# Altium schematic sheet microcontrolador.SchDoc
size A4
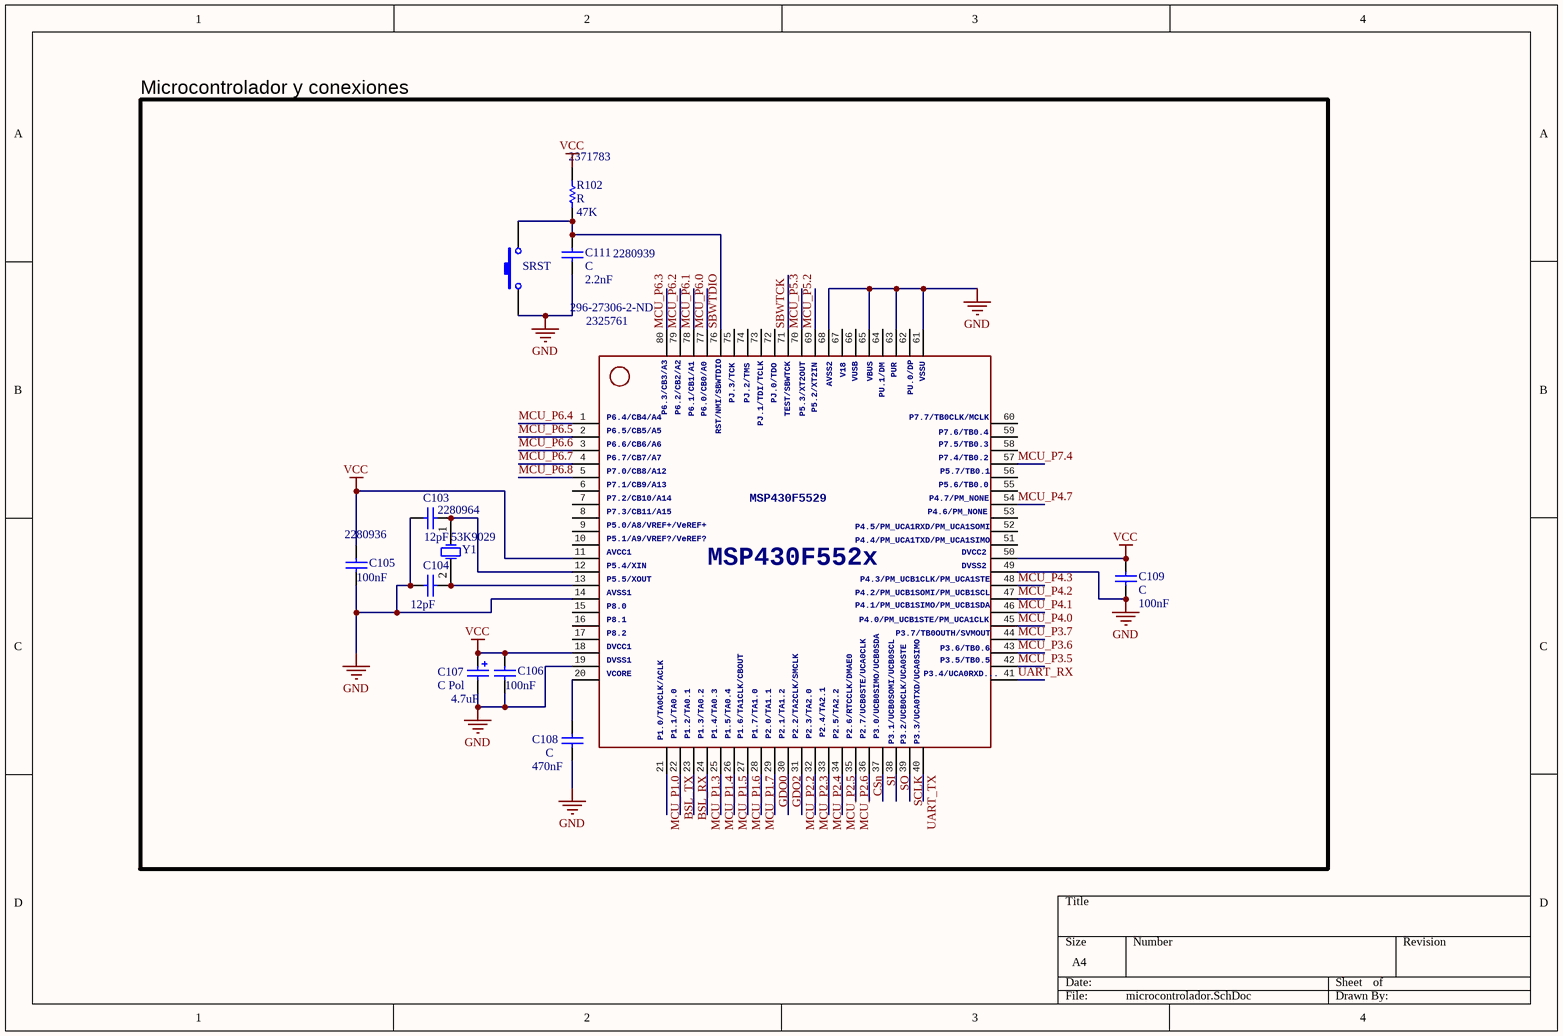
[diagram p0: microcontrolador.SchDoc]

## Parts
C103  value 12pF  Supplier Part Number 1: 2280964  [0805 CAP]  (hidden comment: C)
C104  value 12pF  [0805 CAP]  (hidden comment: C)
C105  value 100nF  Supplier Part Number 2: 2280936  [0805 CAP]  (hidden comment: C)
C106  value 100nF  [0805 CAP]  (hidden comment: C)
C107  C Pol  value 4.7uF  [0805]
C108  C  value 470nF  [0805 CAP]
C109  C  value 100nF  [0805 CAP]
C111  C  value 2.2nF  Supplier Part Number 1: 2280939  [0805 CAP]
MSP430F5529  P3.4/UCA...: P3.4/UCA0RXD...  Supplier Part Number 1: 2325761  Supplier Part Number 2: 296-27306-2-ND  [TI-PN80_N]  (hidden comment: MSP430F5529IPNR)
R102  R  value 47K  Supplier Part Number 1: 2371783  [0805 RES]
SRST  Pulsador  [B3U-1000P]  (value not drawn)
Y1  Supplier Part Number 1: 53K9029  [R38]  (hidden comment: XTAL_CFPX-157_32.768K_SMD)

## Blocks framed on the sheet
Microcontrolador y conexiones: C103-C109 C111 MSP430F5529 R102 SRST Y1

## Nets
GND: C103.1 C104.1 C105.2 C106.2 C107.2 C108.1 C109.1 C111.1 MSP430F5529.14 MSP430F5529.19 MSP430F5529.49 MSP430F5529.61 MSP430F5529.63 MSP430F5529.65 MSP430F5529.68 SRST.1
VCC: C105.1 C106.1 C107.1 C109.2 MSP430F5529.11 MSP430F5529.18 MSP430F5529.50 R102.2
BSL_RX: MSP430F5529.23
BSL_TX: MSP430F5529.22
CSn: MSP430F5529.36
GDO0: MSP430F5529.29
GDO2: MSP430F5529.30
MCU_P1.0: MSP430F5529.21
MCU_P1.3: MSP430F5529.24
MCU_P1.4: MSP430F5529.25
MCU_P1.5: MSP430F5529.26
MCU_P1.6: MSP430F5529.27
MCU_P1.7: MSP430F5529.28
MCU_P2.2: MSP430F5529.31
MCU_P2.3: MSP430F5529.32
MCU_P2.4: MSP430F5529.33
MCU_P2.5: MSP430F5529.34
MCU_P2.6: MSP430F5529.35
MCU_P3.5: MSP430F5529.42
MCU_P3.6: MSP430F5529.43
MCU_P3.7: MSP430F5529.44
MCU_P4.0: MSP430F5529.45
MCU_P4.1: MSP430F5529.46
MCU_P4.2: MSP430F5529.47
MCU_P4.3: MSP430F5529.48
MCU_P4.7: MSP430F5529.54
MCU_P5.2: MSP430F5529.69
MCU_P5.3: MSP430F5529.70
MCU_P6.0: MSP430F5529.77
MCU_P6.1: MSP430F5529.78
MCU_P6.2: MSP430F5529.79
MCU_P6.3: MSP430F5529.80
MCU_P6.4: MSP430F5529.1
MCU_P6.5: MSP430F5529.2
MCU_P6.6: MSP430F5529.3
MCU_P6.7: MSP430F5529.4
MCU_P6.8: MSP430F5529.5
MCU_P7.4: MSP430F5529.57
SBWTCK: MSP430F5529.71
SBWTDIO: C111.2 MSP430F5529.76 R102.1 SRST.2
SCLK: MSP430F5529.39
SI: MSP430F5529.37
SO: MSP430F5529.38
UART_RX: MSP430F5529.41
UART_TX: MSP430F5529.40
NetC103_2: C103.2 MSP430F5529.12 Y1.1(OSC1)
NetC104_2: C104.2 MSP430F5529.13 Y1.2(OSC2)
NetC108_2: C108.2 MSP430F5529.20

Not connected (* = marked no-connect by the designer): MSP430F5529 6 7 8 9 10 15 16 17 51 52 53 55 56 58 59 60 62 64 66 67 72 73 74 75

## Library data of the parts
C103-C106 C108 C109 C111 = C: Capacitor; Manufacturer: Generic Components; Class: Passive; Published: 08/06/2000; Publisher: Altium Hobart Technology Centre; SubClass: Capacitor
  C103 C111: Supplier 1: Farnell
  C105: Supplier 1: Farnell; Supplier 2: Farnell
C107 = C Pol: Polarized Capacitor (Surface Mount); Manufacturer: Generic Components; Class: Passive; Published: 08/06/2000; Publisher: Altium Hobart Technology Centre; SubClass: Capacitor
MSP430F5529 = F552X---PN80: ***MSP430F552X***PN80 / http://www.ti.com/lit/gpn/msp430f5529 / Rev1.0 06/2010    For F552X where X is 1,5,7,9; P6.3/CB3/A3: P6.3/CB3/A3; P6.2/CB2/A2: P6.2/CB2/A2; P6.1/CB1/A1: P6.1/CB1/A1; P6.0/CB0/A0: P6.0/CB0/A0; PJ.3/TCK: PJ.3/TCK; PJ.2/TMS: PJ.2/TMS; PJ.1/TDI/TCLK: PJ.1/TDI/TCLK; PJ.0/TDO: PJ.0/TDO; TEST/SBWTCK: TEST/SBWTCK; P5.3/XT2OUT: P5.3/XT2OUT; P5.2/XT2IN: P5.2/XT2IN; AVSS2: AVSS2; V18: V18; VUSB: VUSB; VBUS: VBUS; PU.1/DM: PU.1/DM; PUR: PUR; PU.0/DP: PU.0/DP; VSSU: VSSU; RST/NMI/SBWTDIO: RST/NMI/SBWTDIO; P7.7/TB0CLK/MCLK: P7.7/TB0CLK/MCLK; P7.6/TB0.4: P7.6/TB0.4; P7.5/TB0.3: P7.5/TB0.3; P7.4/TB0.2: P7.4/TB0.2; P5.7/TB0.1: P5.7/TB0.1; P5.6/TB0.0: P5.6/TB0.0; P4.7/PM_NONE: P4.7/PM_NONE; P4.5/PM_UCA1RXD/PM_UCA1SOMI: P4.5/PM_UCA1RXD/PM_UCA1SOMI; P4.4/PM_UCA1TXD/PM_UCA1SIMO: P4.4/PM_UCA1TXD/PM_UCA1SIMO; DVCC2: DVCC2; P4.3/PM_UCB1CLK/PM_UCA1STE: P4.3/PM_UCB1CLK/PM_UCA1STE; P4.2/PM_UCB1SOMI/PM_UCB1SCL: P4.2/PM_UCB1SOMI/PM_UCB1SCL; P4.1/PM_UCB1SIMO/PM_UCB1SDA: P4.1/PM_UCB1SIMO/PM_UCB1SDA; P4.0/PM_UCB1STE/PM_UCA1CLK: P4.0/PM_UCB1STE/PM_UCA1CLK; P3.7/TB0OUTH/SVMOUT: P3.7/TB0OUTH/SVMOUT; P3.6/TB0.6: P3.6/TB0.6; P4.6/PM_NONE: P4.6/PM_NONE; P3.5/TB0.5: P3.5/TB0.5; P1.0/TA0CLK/ACLK: P1.0/TA0CLK/ACLK; P1.1/TA0.0: P1.1/TA0.0; P1.2/TA0.1: P1.2/TA0.1; P1.3/TA0.2: P1.3/TA0.2; P1.4/TA0.3: P1.4/TA0.3; P1.5/TA0.4: P1.5/TA0.4; P1.6/TA1CLK/CBOUT: P1.6/TA1CLK/CBOUT; P1.7/TA1.0: P1.7/TA1.0; P2.0/TA1.1: P2.0/TA1.1; P2.1/TA1.2: P2.1/TA1.2; P2.2/TA2CLK/SMCLK: P2.2/TA2CLK/SMCLK; P2.4/TA2.1: P2.4/TA2.1; P2.5/TA2.2: P2.5/TA2.2; P2.6/RTCCLK/DMAE0: P2.6/RTCCLK/DMAE0; P2.7/UCB0STE/UCA0CLK: P2.7/UCB0STE/UCA0CLK; P3.0/UCB0SIMO/UCB0SDA: P3.0/UCB0SIMO/UCB0SDA; P3.1/UCB0SOMI/UCB0SCL: P3.1/UCB0SOMI/UCB0SCL; P3.2/UCB0CLK/UCA0STE: P3.2/UCB0CLK/UCA0STE; P3.3/UCA0TXD/UCA0SIMO: P3.3/UCA0TXD/UCA0SIMO; P6.4/CB4/A4: P6.4/CB4/A4; P6.5/CB5/A5: P6.5/CB5/A5; P6.6/CB6/A6: P6.6/CB6/A6; P6.7/CB7/A7: P6.7/CB7/A7; P7.0/CB8/A12: P7.0/CB8/A12; P7.1/CB9/A13: P7.1/CB9/A13; P7.2/CB10/A14: P7.2/CB10/A14; P7.3/CB11/A15: P7.3/CB11/A15; P5.0/A8/VREF+/VeREF+: P5.0/A8/VREF+/VeREF+; P5.1/A9/VREF?/VeREF?: P5.1/A9/VREF?/VeREF?; AVCC1: AVCC1; P5.4/XIN: P5.4/XIN; P5.5/XOUT: P5.5/XOUT; AVSS1: AVSS1; P8.0: P8.0; P8.1: P8.1; P8.2: P8.2; DVCC1: DVCC1; DVSS1: DVSS1; VCORE: VCORE; MSP430F552x: MSP430F552x; DVSS2: DVSS2; P2.3/TA2.0: P2.3/TA2.0; Supplier 1: Farnell; Supplier 2: Digi-Key
R102 = R: Resistor; Manufacturer: Generic Components; Class: Passive; Published: 08/06/2000; Publisher: Altium Hobart Technology Centre; SubClass: Resistor; Supplier 1: Farnell
SRST = Pulsador_1: Switch; Manufacturer: Generic Components; Published: 1999
Y1 = XTAL_CFPX-157_32.768K_SMD: Crystal Oscillator; Manufacturer: Generic Components; Published: 08/06/2000; Publisher: Altium Hobart Technology Centre; Class: Oscillator; SubClass: Crystal Oscillator; Supplier 1: Newark